# EAGLE design layer4 (EAGLE 9.6.2)

## Sheet 1 of 3: Ultra
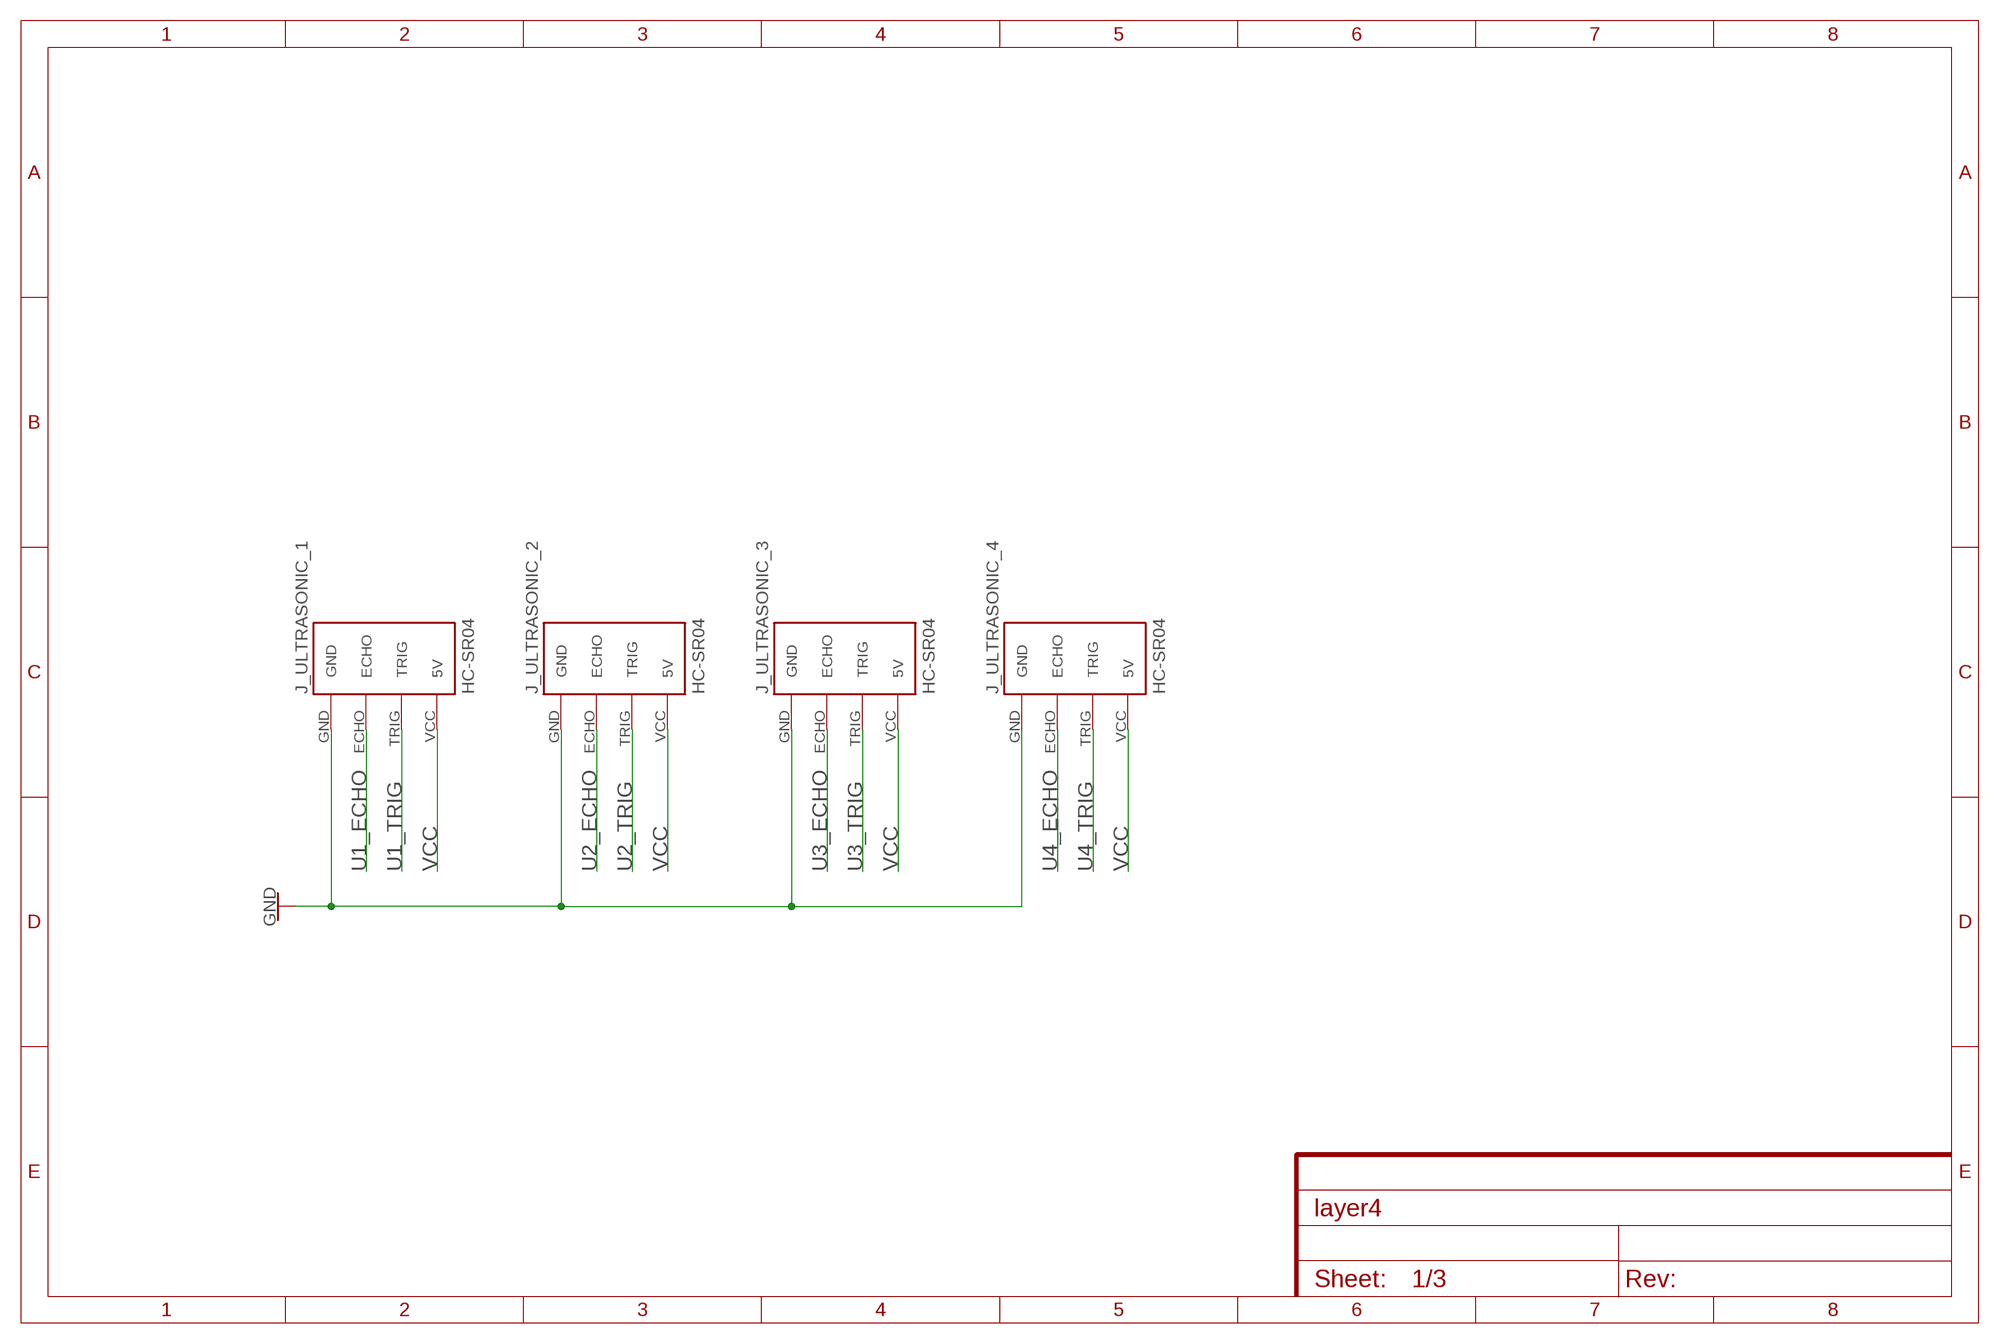
[diagram p0: schematic, sheet 1]

### Parts
J_ULTRASONIC_1  HC-SR04  [HC-SR04_FOOTPRINT]
J_ULTRASONIC_2  HC-SR04  [HC-SR04_FOOTPRINT]
J_ULTRASONIC_3  HC-SR04  [HC-SR04_FOOTPRINT]
J_ULTRASONIC_4  HC-SR04  [HC-SR04_FOOTPRINT]

### Nets
GND: J_ULTRASONIC_1.GND J_ULTRASONIC_2.GND J_ULTRASONIC_3.GND J_ULTRASONIC_4.GND ; also sheet 2,3
U1_ECHO: J_ULTRASONIC_1.ECHO ; also sheet 3
U1_TRIG: J_ULTRASONIC_1.TRIG ; also sheet 3
U2_ECHO: J_ULTRASONIC_2.ECHO ; also sheet 3
U2_TRIG: J_ULTRASONIC_2.TRIG ; also sheet 3
U3_ECHO: J_ULTRASONIC_3.ECHO ; also sheet 3
U3_TRIG: J_ULTRASONIC_3.TRIG ; also sheet 3
U4_ECHO: J_ULTRASONIC_4.ECHO ; also sheet 3
U4_TRIG: J_ULTRASONIC_4.TRIG ; also sheet 3
VCC: J_ULTRASONIC_1.VCC(5V) J_ULTRASONIC_2.VCC(5V) J_ULTRASONIC_3.VCC(5V) J_ULTRASONIC_4.VCC(5V) ; also sheet 3

## Sheet 2 of 3: Compass
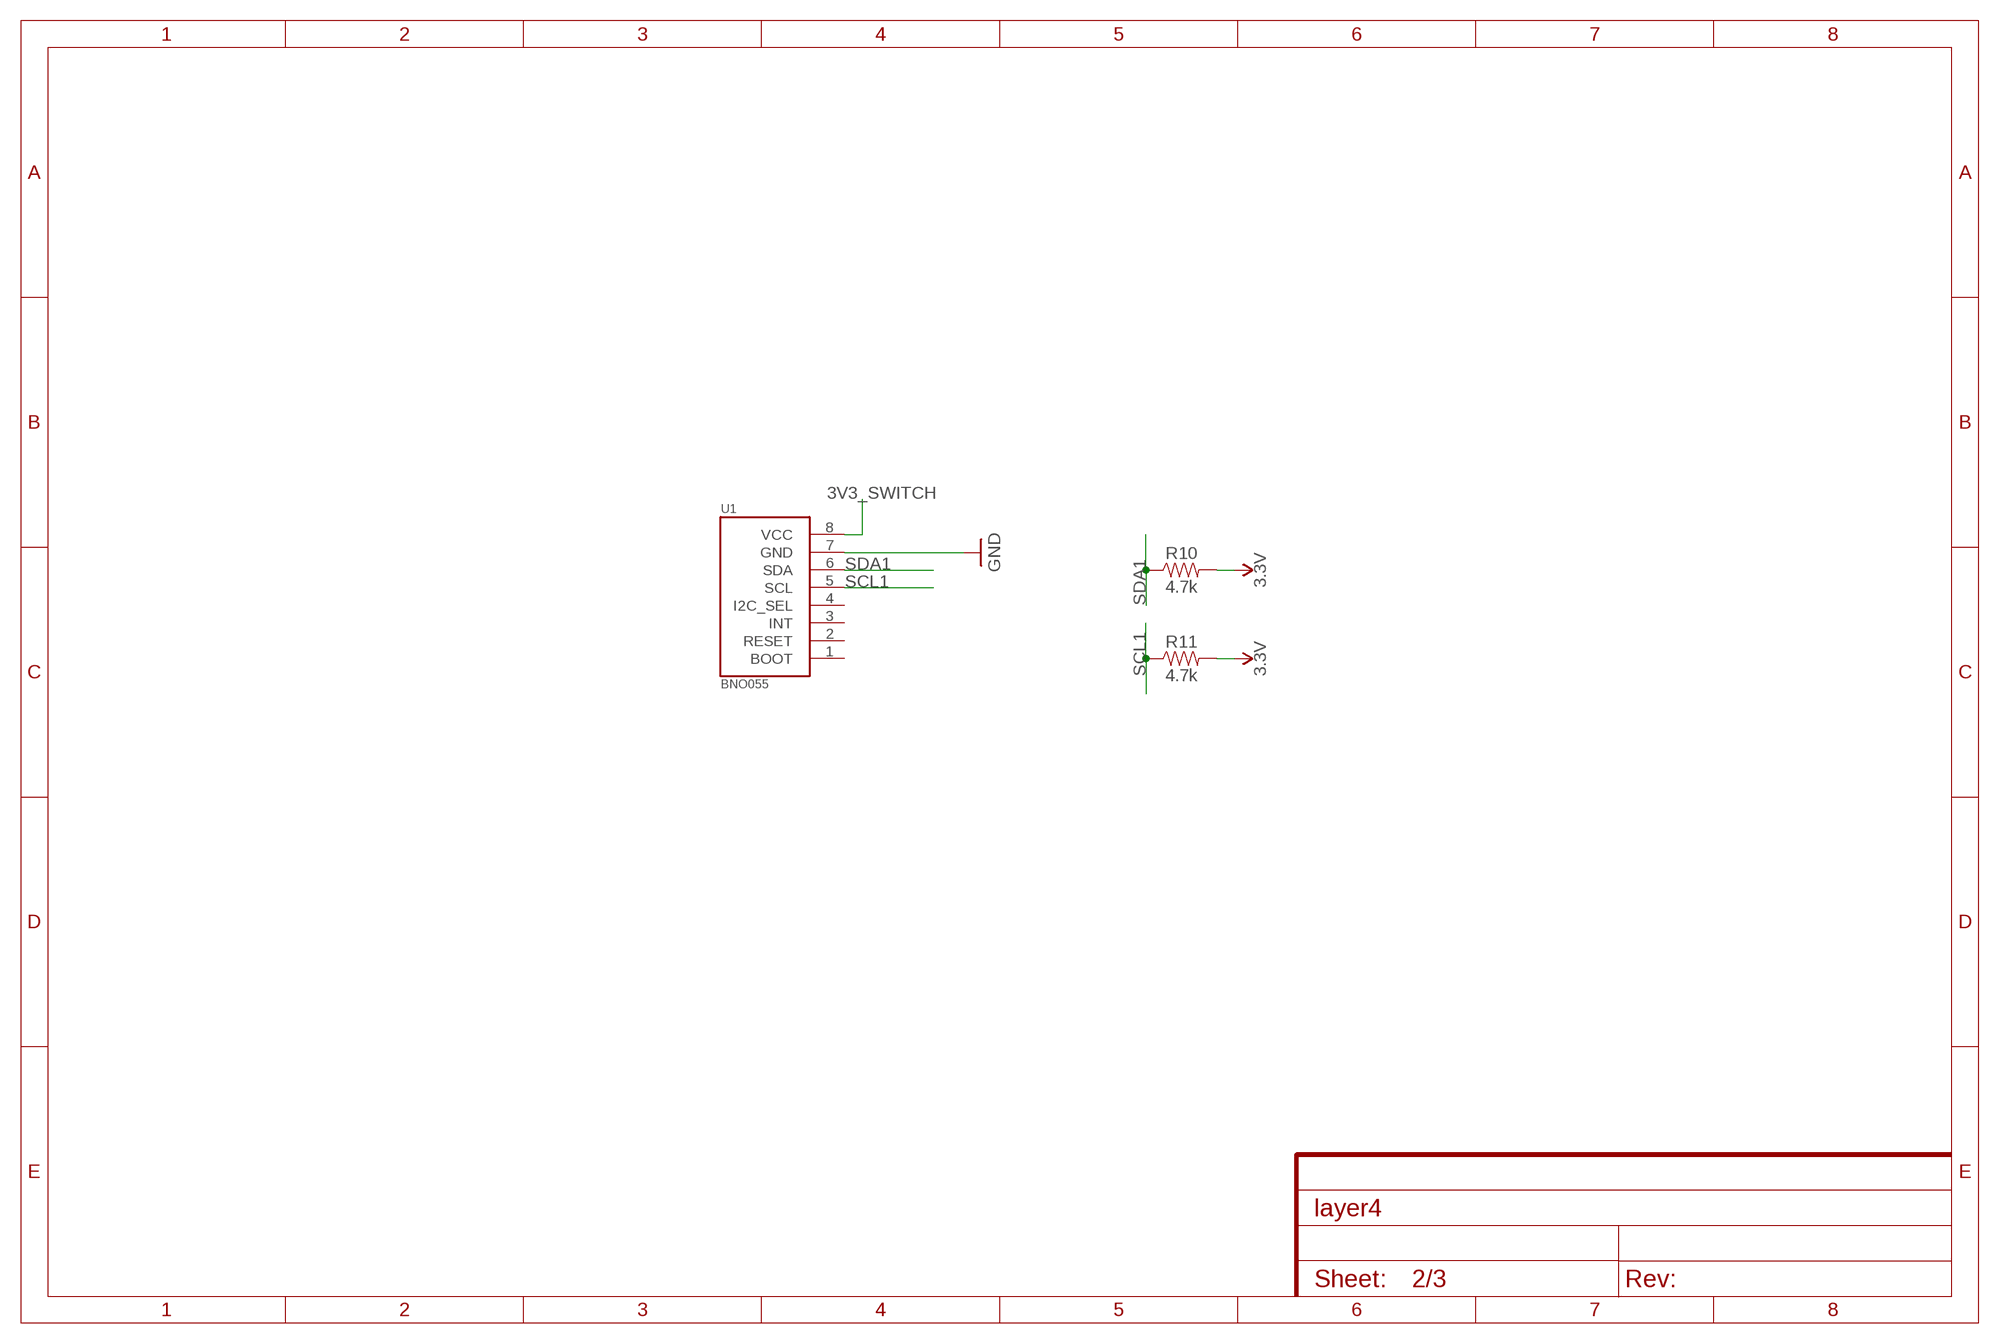
[diagram p1: schematic, sheet 2]

### Parts
R10  4.7k  4.7KOHM-0603-1/10W-1%  [0603]
R11  4.7k  4.7KOHM-0603-1/10W-1%  [0603]
U1  BNO055  [BNO055]

### Nets
3.3V: R10.2 R11.2
3V3_SWITCH: U1.8(VCC) ; also sheet 3
GND: U1.7(GND) ; also sheet 1,3
SCL1: R11.1 U1.5(SCL) ; also sheet 3
SDA1: R10.1 U1.6(SDA) ; also sheet 3
Unconnected: U1.1(BOOT) U1.2(RESET) U1.3(INT) U1.4(I2C_SEL)

## Sheet 3 of 3: STM32
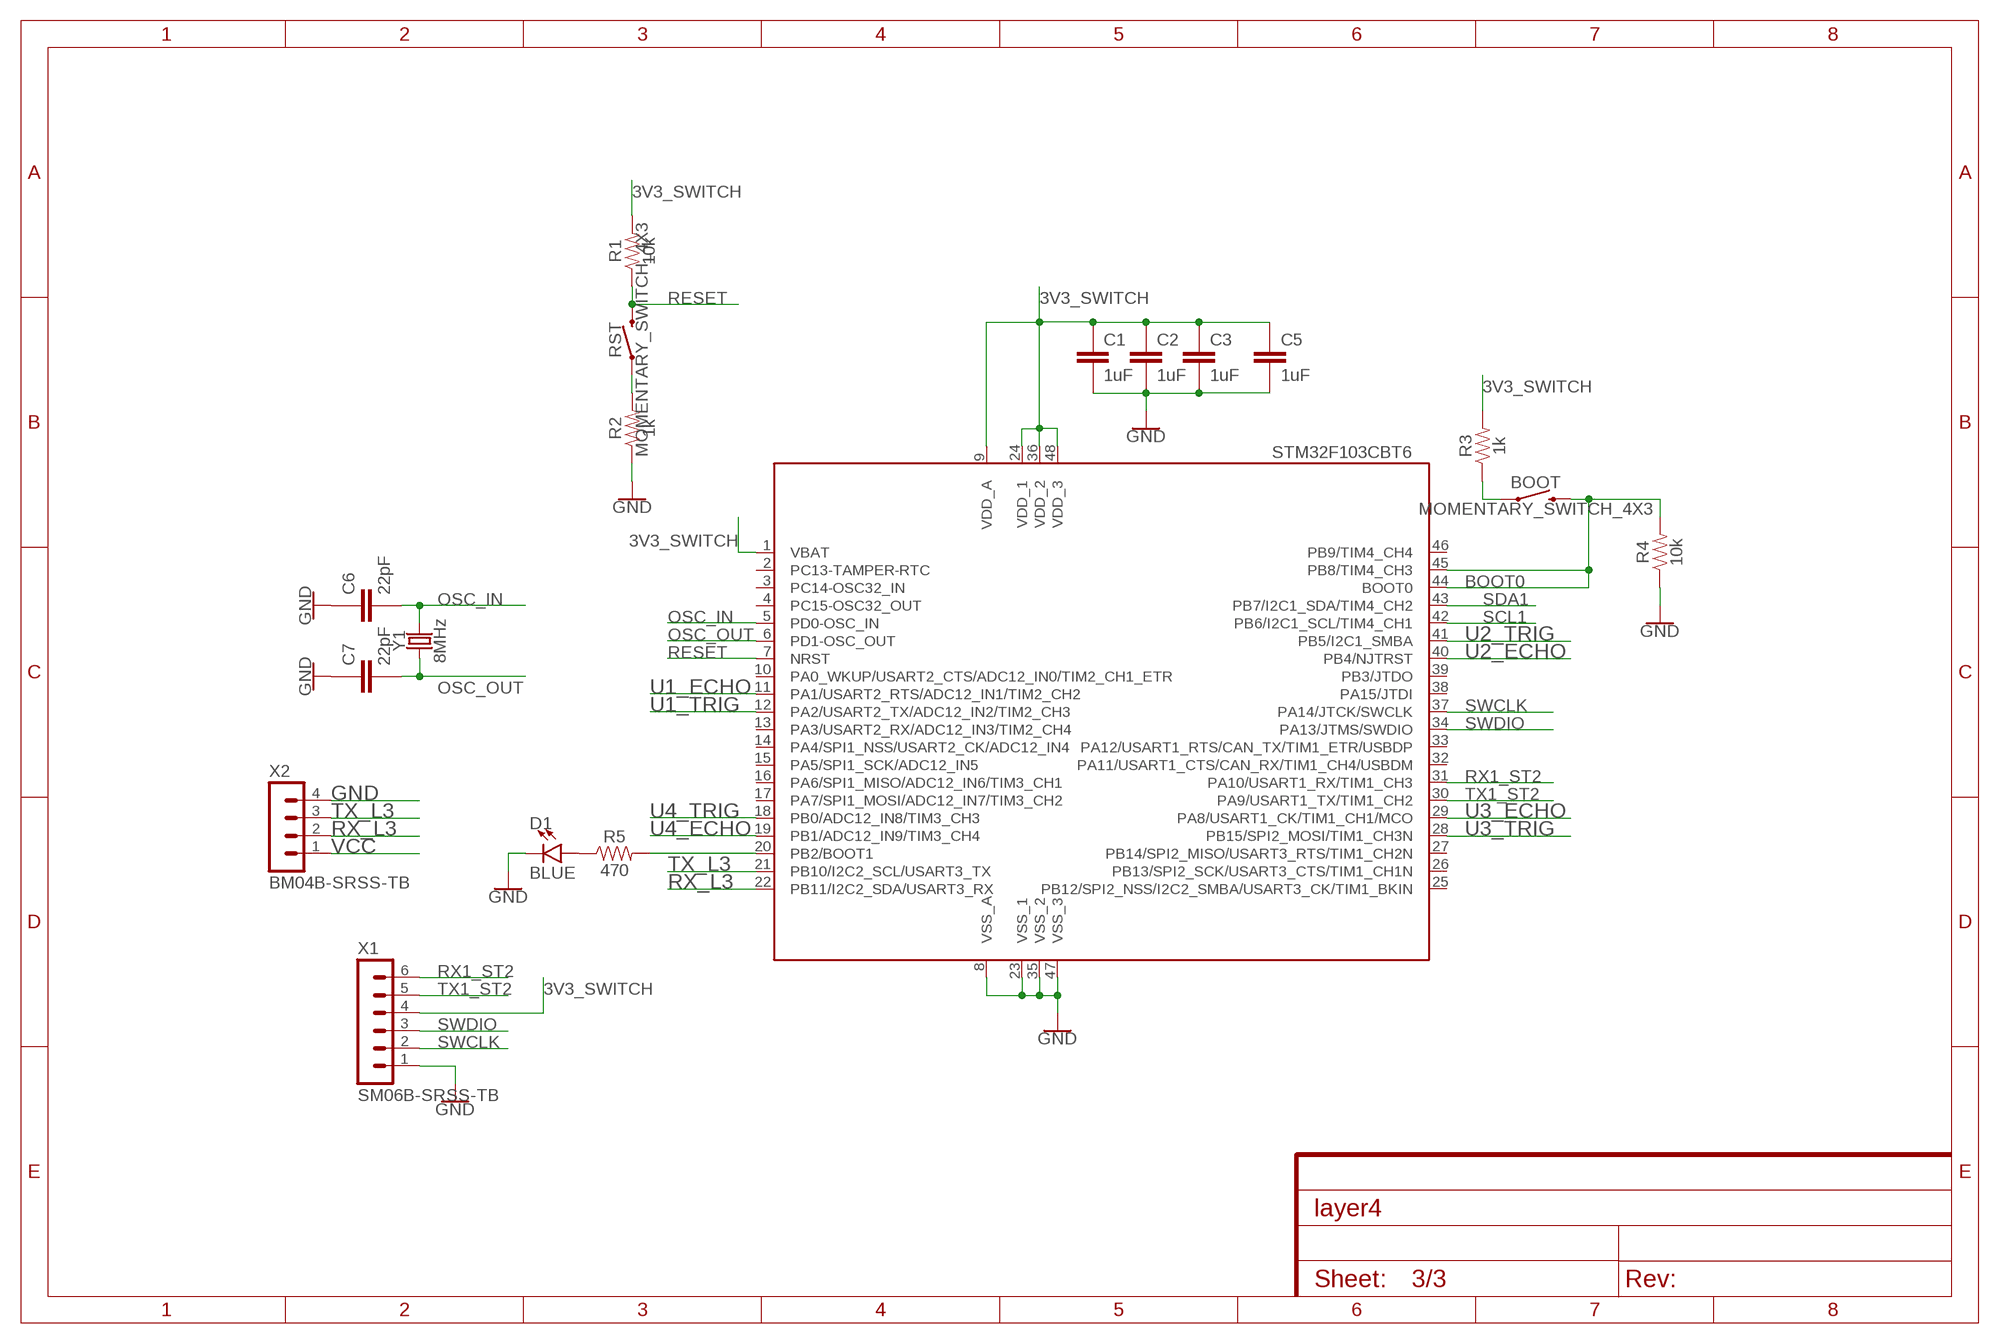
[diagram p2: schematic, sheet 3]

### Parts
BOOT  MOMENTARY_SWITCH_4X3  [MOMENTARY_SWITCH_4X3]
C1  1uF  CAPACITOR0603  [C0603]
C2  1uF  CAPACITOR0603  [C0603]
C3  1uF  CAPACITOR0603  [C0603]
C5  1uF  CAPACITOR0603  [C0603]
C6  22pF  CAPACITOR0603  [C0603]
C7  22pF  CAPACITOR0603  [C0603]
D1  BLUE  LED0603  [LED-0603]
R1  10k  RESISTOR0603  [R0603]
R2  1k  RESISTOR0603  [R0603]
R3  1k  RESISTOR0603  [R0603]
R4  10k  RESISTOR0603  [R0603]
R5  470  RESISTOR0603  [R0603]
RST  MOMENTARY_SWITCH_4X3  [MOMENTARY_SWITCH_4X3]
STM32_IR  STM32F103CBT6  [LQFP48]
X1  SM06B-SRSS-TB  [SM06B-SRSS-TB]
X2  BM04B-SRSS-TB  [BM04B-SRSS-TB]
Y1  8MHz  CRYSTALSMD-5X3.2-2PAD  [CRYSTAL-SMD-5X3.2-2PAD]

### Nets
3V3_SWITCH: C1.1 C2.1 C3.1 C5.2 R1.2 R3.2 STM32_IR.1(VBAT) STM32_IR.9(VDD_A) STM32_IR.24(VDD_1) STM32_IR.36(VDD_2) STM32_IR.48(VDD_3) X1.4 ; also sheet 2
BOOT0: BOOT.P$2 R4.2 STM32_IR.44(BOOT0) STM32_IR.45(PB8/TIM4_CH3)
GND: C1.2 C2.2 C3.2 C5.1 C6.1 C7.1 D1.C R2.1 R4.1 STM32_IR.8(VSS_A) STM32_IR.23(VSS_1) STM32_IR.35(VSS_2) STM32_IR.47(VSS_3) X1.1 X2.4 ; also sheet 1,2
N$70: R2.2 RST.P$1
N$72: BOOT.P$1 R3.1
N$73: R5.2 STM32_IR.20(PB2/BOOT1)
N$74: D1.A R5.1
OSC_IN: C6.2 STM32_IR.5(PD0-OSC_IN) Y1.P$2
OSC_OUT: C7.2 STM32_IR.6(PD1-OSC_OUT) Y1.P$1
RESET: R1.1 RST.P$2 STM32_IR.7(NRST)
RX1_ST2: STM32_IR.31(PA10/USART1_RX/TIM1_CH3) X1.6
RX_L3: STM32_IR.22(PB11/I2C2_SDA/USART3_RX) X2.2
SCL1: STM32_IR.42(PB6/I2C1_SCL/TIM4_CH1) ; also sheet 2
SDA1: STM32_IR.43(PB7/I2C1_SDA/TIM4_CH2) ; also sheet 2
SWCLK: STM32_IR.37(PA14/JTCK/SWCLK) X1.2
SWDIO: STM32_IR.34(PA13/JTMS/SWDIO) X1.3
TX1_ST2: STM32_IR.30(PA9/USART1_TX/TIM1_CH2) X1.5
TX_L3: STM32_IR.21(PB10/I2C2_SCL/USART3_TX) X2.3
U1_ECHO: STM32_IR.11(PA1/USART2_RTS/ADC12_IN1/TIM2_CH2) ; also sheet 1
U1_TRIG: STM32_IR.12(PA2/USART2_TX/ADC12_IN2/TIM2_CH3) ; also sheet 1
U2_ECHO: STM32_IR.40(PB4/NJTRST) ; also sheet 1
U2_TRIG: STM32_IR.41(PB5/I2C1_SMBA) ; also sheet 1
U3_ECHO: STM32_IR.29(PA8/USART1_CK/TIM1_CH1/MCO) ; also sheet 1
U3_TRIG: STM32_IR.28(PB15/SPI2_MOSI/TIM1_CH3N) ; also sheet 1
U4_ECHO: STM32_IR.19(PB1/ADC12_IN9/TIM3_CH4) ; also sheet 1
U4_TRIG: STM32_IR.18(PB0/ADC12_IN8/TIM3_CH3) ; also sheet 1
VCC: X2.1 ; also sheet 1
Unconnected: STM32_IR.2(PC13-TAMPER-RTC) STM32_IR.3(PC14-OSC32_IN) STM32_IR.4(PC15-OSC32_OUT) STM32_IR.10(PA0_WKUP/USART2_CTS/ADC12_IN0/TIM2_CH1_ETR) STM32_IR.13(PA3/USART2_RX/ADC12_IN3/TIM2_CH4) STM32_IR.14(PA4/SPI1_NSS/USART2_CK/ADC12_IN4) STM32_IR.15(PA5/SPI1_SCK/ADC12_IN5) STM32_IR.16(PA6/SPI1_MISO/ADC12_IN6/TIM3_CH1) STM32_IR.17(PA7/SPI1_MOSI/ADC12_IN7/TIM3_CH2) STM32_IR.25(PB12/SPI2_NSS/I2C2_SMBA/USART3_CK/TIM1_BKIN) STM32_IR.26(PB13/SPI2_SCK/USART3_CTS/TIM1_CH1N) STM32_IR.27(PB14/SPI2_MISO/USART3_RTS/TIM1_CH2N) STM32_IR.32(PA11/USART1_CTS/CAN_RX/TIM1_CH4/USBDM) STM32_IR.33(PA12/USART1_RTS/CAN_TX/TIM1_ETR/USBDP) STM32_IR.38(PA15/JTDI) STM32_IR.39(PB3/JTDO) STM32_IR.46(PB9/TIM4_CH4)

## Library data of the parts
BOOT RST = MY-LIBRARY:MOMENTARY_SWITCH_4X3
C1-C3 C5-C7 = JH:CAPACITOR
D1 = SparkFun-LED:LED: LED (Generic) Standard schematic elements and footprints for 5mm, 3mm, 1206, and 0603 sized LEDs. Generic LEDs with no color specified.
J_ULTRASONIC_1-J_ULTRASONIC_4 = Ultrasonic Sensor HC-SR04:HC-SR04: Ultrasonic Sensor HC-SR04
R1-R5 = JH:RESISTOR
R10 R11 = SparkFun-Resistors:4.7KOHM: 4.7kΩ resistor A resistor is a passive two-terminal electrical component that implements electrical resistance as a circuit element. Resistors act to reduce current flow, and, at the same time, act to lower voltage levels within circuits. - Wikipedia; PROD_ID: RES-07857
STM32_IR = JH:STM32F103CBT6
U1 = JH:BNO055
X1 = con-JST SH:SM06B-SRSS: JST SH series header 1.00mm pitch disconnectable crimp style connectors, horizontal (side entry type), 6 pins
X2 = con-JST SH:BM04B-SRSS: JST SH series header 1.00mm pitch disconnectable crimp style connectors, vertical (side entry type), 4 pins
Y1 = SparkFun-Clocks:CRYSTAL: Crystals (Generic) These are passive quartz crystals, which can be used as a clock source for a microcontroller. Crystal's are two-terminal devices. They require external "load" capacitors to generate an oscillating signal.

## Board
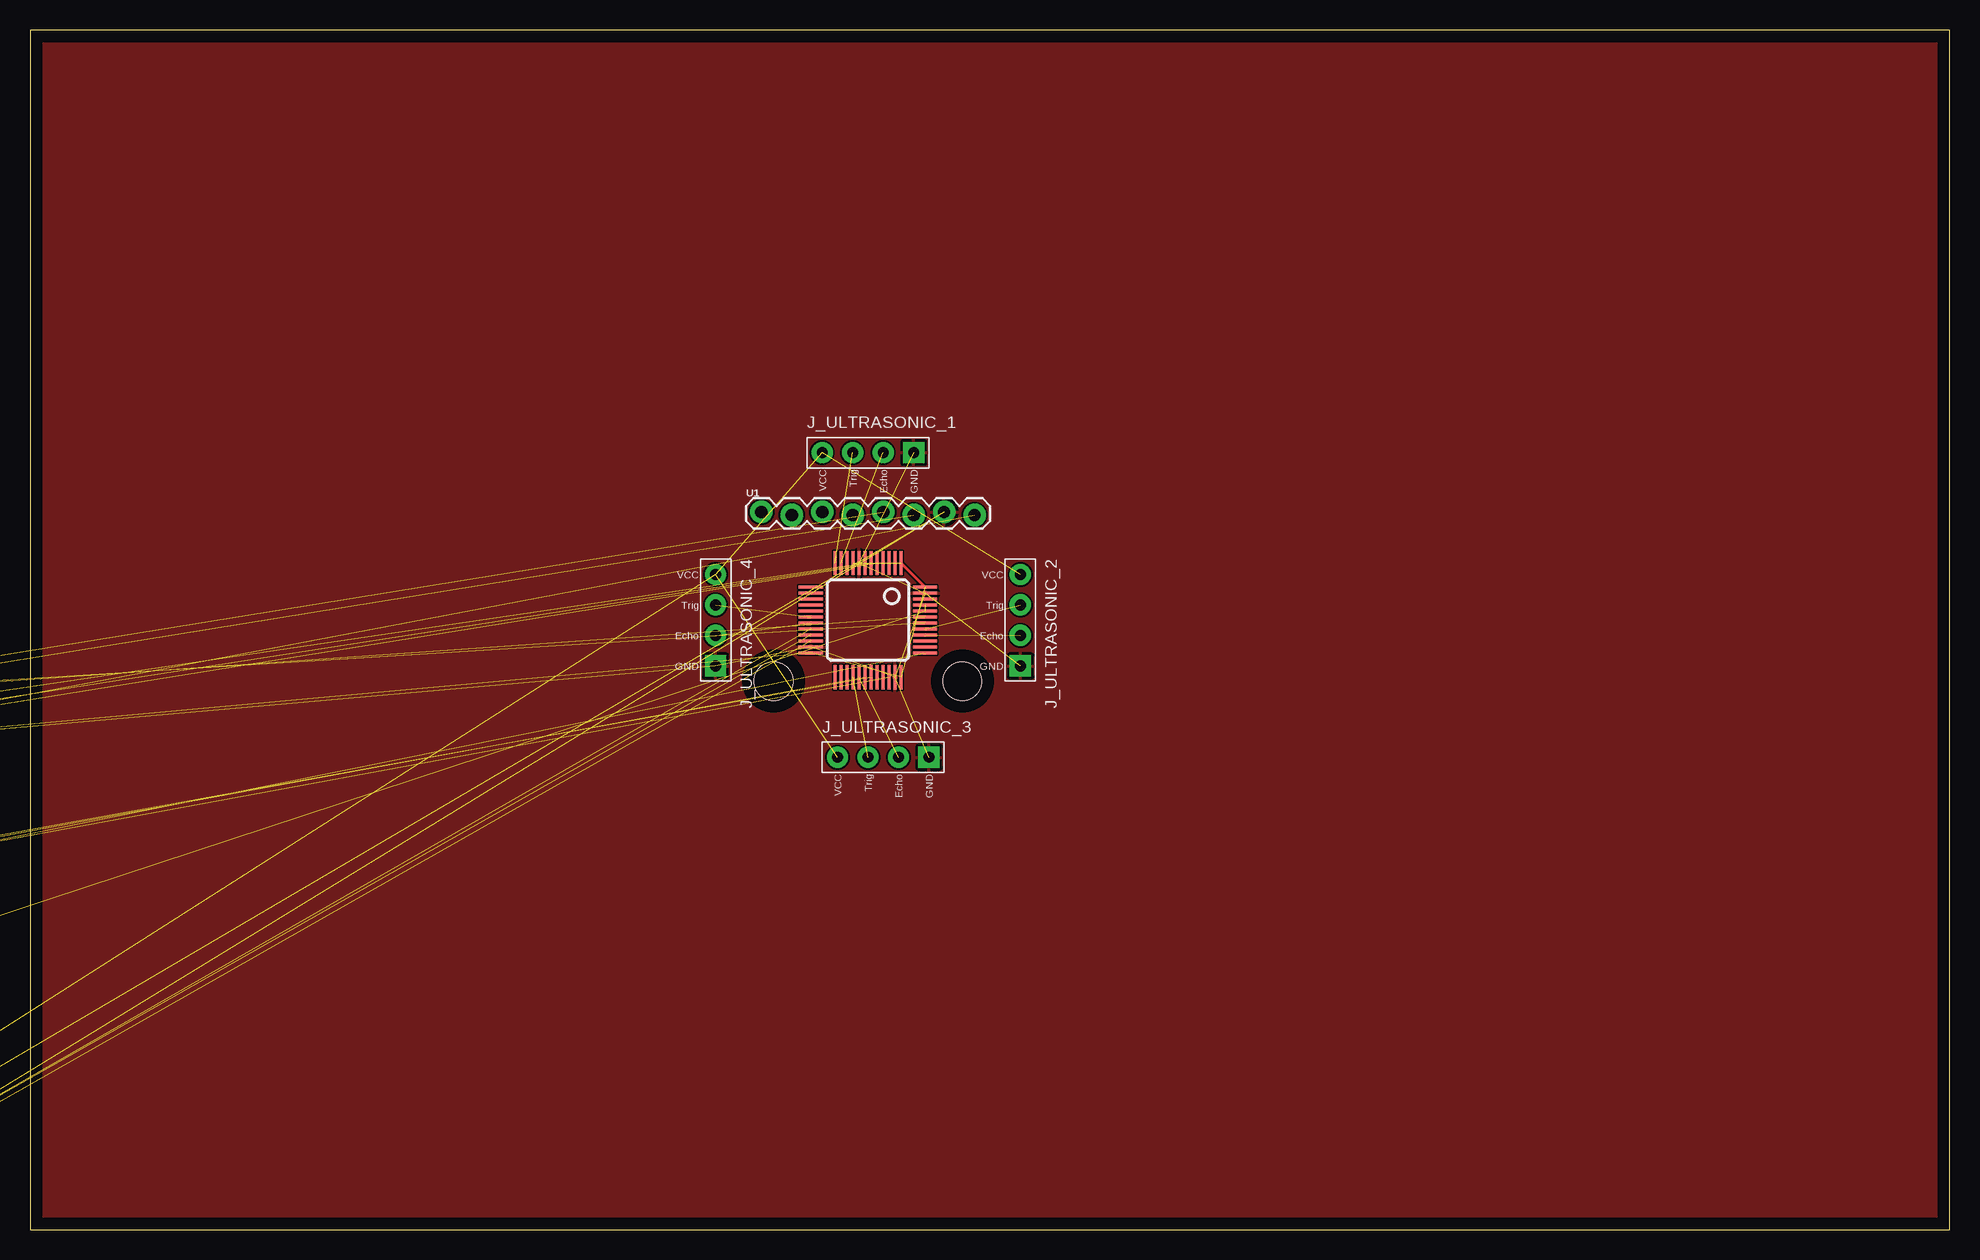
[diagram p3: board, top side]
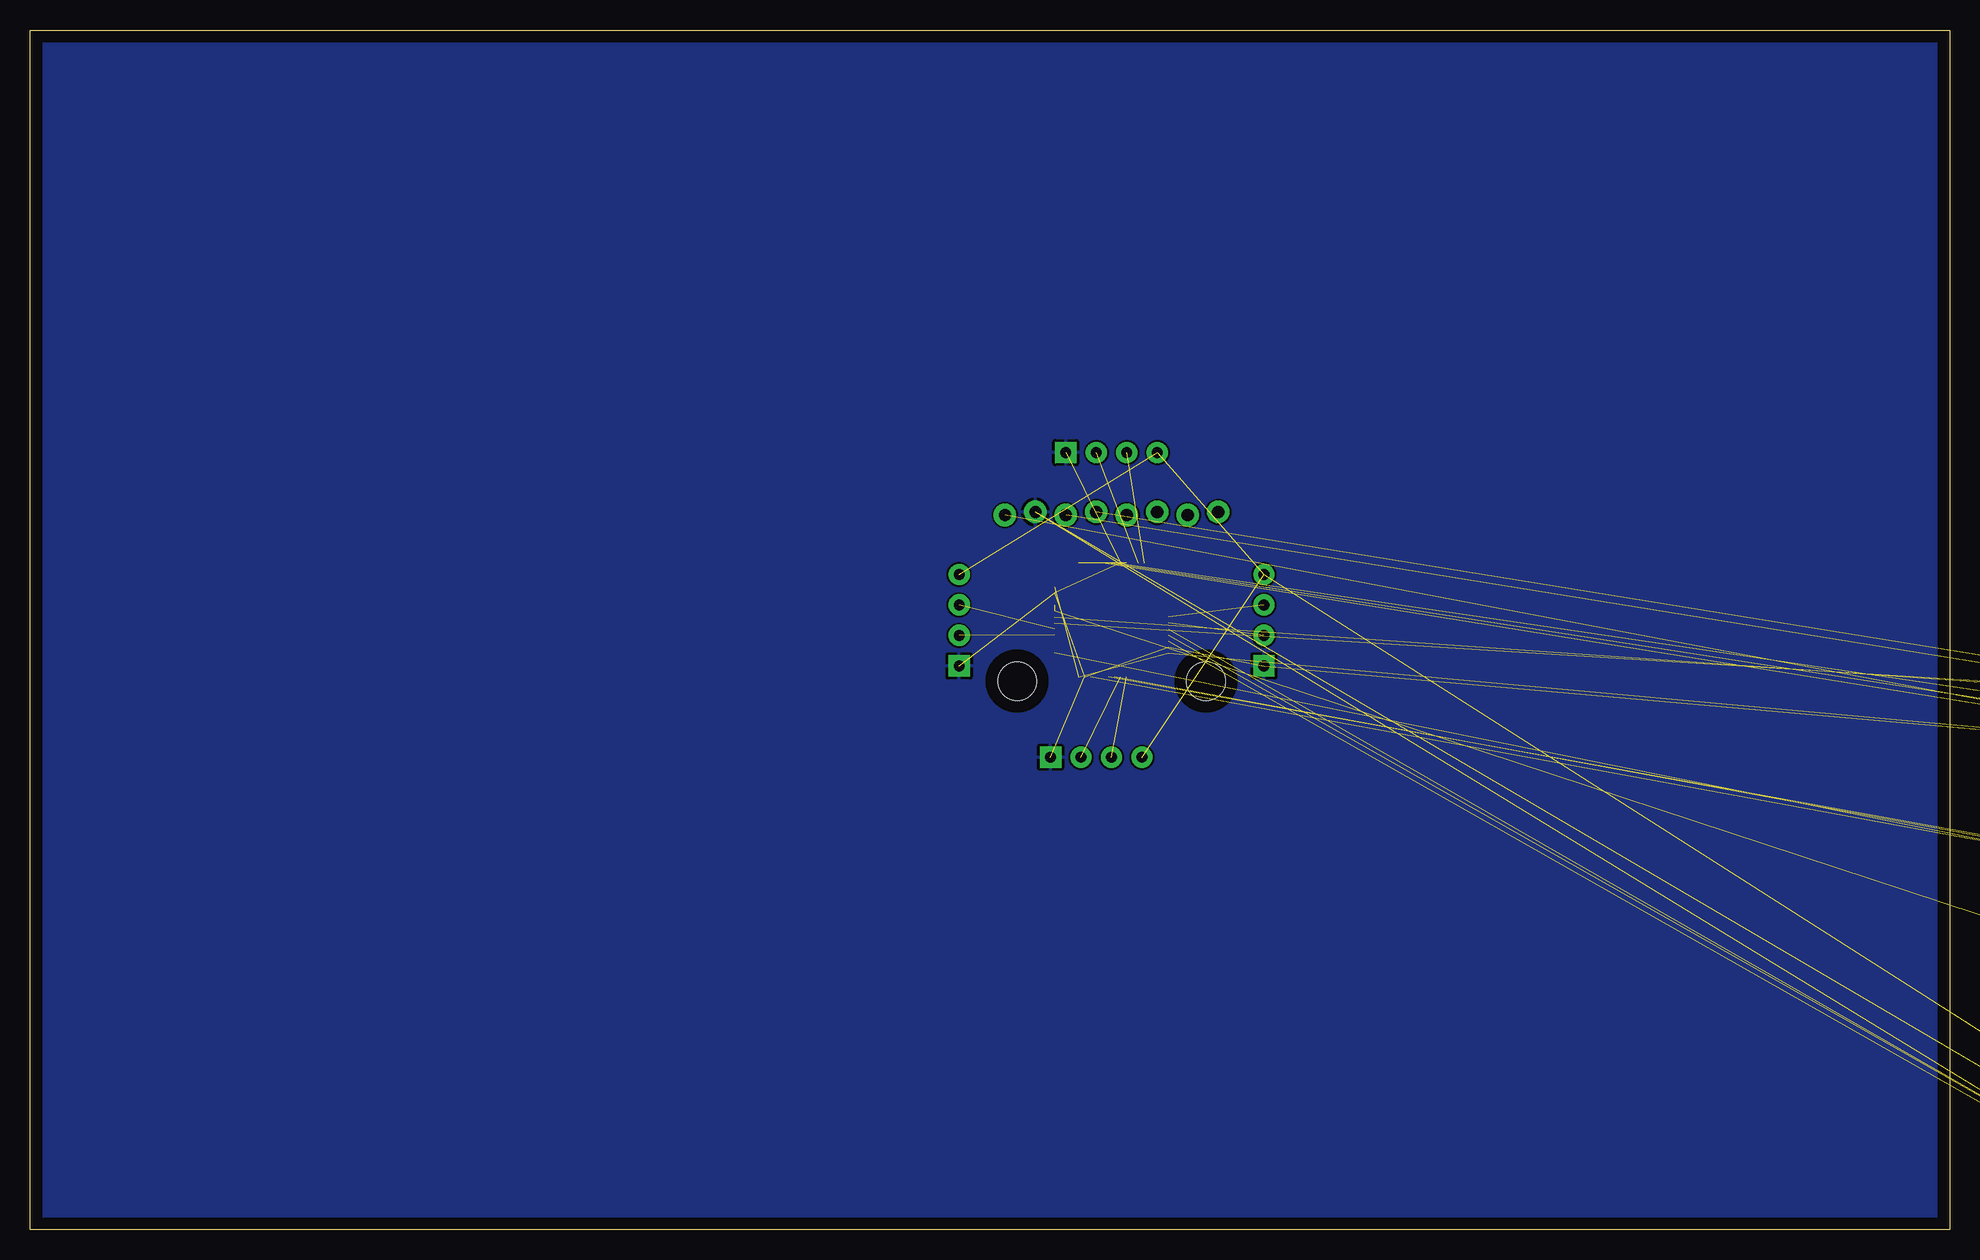
[diagram p4: board, bottom side, seen from below]

Size 160 x 100 mm. Coordinates in mm from the lower left corner, seen from the top.
Outline: 0,0 160,0 160,100 0,100 0,0
Copper layers (1*16): Top 0.035mm / dielectric 1.5mm / Bottom 0.035mm
Design rules "default": minimum track width 6mil, minimum drill 0.35mm, track to track 6mil, track to pad 6mil, pad to pad 6mil, via to via 6mil, smd to smd 6mil, copper to edge 40mil, drill to drill 6mil, minimum pad ring 10mil, minimum via ring 8mil, stop-mask expansion 4mil, vias tented up to drill 0mil, thermal gap 10mil

### Footprints (pad centres in the part's own frame; a part is rotated, then mirrored left to right if it is on the bottom)
MOMENTARY_SWITCH_4X3 = smd 1.3 x 1.6: P$1 -2.25,0; P$2 2.25,0
C0603 = smd 1.1 x 1: 1 -0.85,0; 2 0.85,0
LED-0603 = smd 1 x 1: A -0.877,0; C 0.877,0
HC-SR04_FOOTPRINT = drill 0.9 pad 1.778: ECHO 0,1.27; TRIG 0,-1.27; VCC 0,-3.81 | drill 0.9 pad 1.778 square: GND 0,3.81
R0603 = smd 1.1 x 1: 1 -0.85,0; 2 0.85,0
0603 = smd 1.1 x 1: 1 -0.85,0; 2 0.85,0
LQFP48 = smd 0.254 x 2.032: 1 -2.75,-4.758; 2 -2.25,-4.758; 3 -1.75,-4.758; 4 -1.25,-4.758; 5 -0.75,-4.758; 6 -0.25,-4.758; 7 0.25,-4.758; 8 0.75,-4.758; 9 1.25,-4.758; 10 1.75,-4.758; 11 2.25,-4.758; 12 2.75,-4.758; 25 2.75,4.758; 26 2.25,4.758; 27 1.75,4.758; 28 1.25,4.758; 29 0.75,4.758; 30 0.25,4.758; 31 -0.25,4.758; 32 -0.75,4.758; 33 -1.25,4.758; 34 -1.75,4.758; 35 -2.25,4.758; 36 -2.75,4.758 | smd 2.032 x 0.254: 13 4.758,-2.75; 14 4.758,-2.25; 15 4.758,-1.75; 16 4.758,-1.25; 17 4.758,-0.75; 18 4.758,-0.25; 19 4.758,0.25; 20 4.758,0.75; 21 4.758,1.25; 22 4.758,1.75; 23 4.758,2.25; 24 4.758,2.75; 37 -4.758,2.75; 38 -4.758,2.25; 39 -4.758,1.75; 40 -4.758,1.25; 41 -4.758,0.75; 42 -4.758,0.25; 43 -4.758,-0.25; 44 -4.758,-0.75; 45 -4.758,-1.25; 46 -4.758,-1.75; 47 -4.758,-2.25; 48 -4.758,-2.75
BNO055 = drill 1.016 pad 1.88: 1 -8.89,14.097; 2 -6.35,13.843; 3 -3.81,14.097; 4 -1.27,13.843; 5 1.27,14.097; 6 3.81,13.843; 7 6.35,14.097; 8 8.89,13.843 | hole 3.2: -7.874,0; 7.874,0
SM06B-SRSS-TB = smd 0.6 x 1.55: 1 2.5,0; 2 1.5,0; 3 0.5,0; 4 -0.5,0; 5 -1.5,0; 6 -2.5,0 | smd 1.2 x 1.8: M1 3.8,3.875; M2 -3.8,3.875
BM04B-SRSS-TB = smd 0.6 x 1.55: 1 1.5,0; 2 0.5,0; 3 -0.5,0; 4 -1.5,0 | smd 1.2 x 1.8: M1 2.8,-2.525; M2 -2.8,-2.525
CRYSTAL-SMD-5X3.2-2PAD = smd 1.7 x 2.4: P$1 1.85,0; P$2 -1.85,0

### Placement (x,y rotation side)
BOOT  -34.29,16.51 0 top  (outside the outline)
C1  -36.83,36.83 0 top  (outside the outline)
C2  -40.64,36.83 0 top  (outside the outline)
C3  -15.24,40.64 0 top  (outside the outline)
C5  -19.05,40.64 0 top  (outside the outline)
C6  -22.86,40.64 0 top  (outside the outline)
C7  -26.67,40.64 0 top  (outside the outline)
D1  -118.11,-58.42 0 top  (outside the outline)
J_ULTRASONIC_1  69.85,64.77 270 top
J_ULTRASONIC_2  82.55,50.8 180 top
J_ULTRASONIC_3  71.12,39.37 270 top
J_ULTRASONIC_4  57.15,50.8 180 top
R1  -30.48,40.64 0 top  (outside the outline)
R2  -34.29,40.64 0 top  (outside the outline)
R3  -38.1,40.64 0 top  (outside the outline)
R4  -41.91,40.64 0 top  (outside the outline)
R5  -118.11,-54.61 0 top  (outside the outline)
R10  -19.05,44.45 0 top  (outside the outline)
R11  -22.86,44.45 0 top  (outside the outline)
RST  -34.29,24.13 0 top  (outside the outline)
STM32_IR  69.85,50.8 180 top
U1  69.85,45.72 0 top
X1  -20.32,29.21 0 top  (outside the outline)
X2  -97.79,-43.18 0 top  (outside the outline)
Y1  -33.02,30.48 0 top  (outside the outline)

### Tracks (layer width: path | path; a pad name or v marks a point on that pad's centre or on a via)
3.3V  (1 unrouted)
3V3_SWITCH  (11 unrouted)
  Top 0.254: STM32_IR.48 STM32_IR.1
BOOT0  (3 unrouted)
GND  (19 unrouted)
  pour Top: -139.7,187.96 -139.7,-66.04 298.45,-66.04 298.45,187.96
  pour Bottom: -138.43,190.5 -138.43,-64.77 300.99,-64.77 300.99,190.5
N$70  (1 unrouted)
N$72  (1 unrouted)
N$73  (1 unrouted)
N$74  (1 unrouted)
OSC_IN  (2 unrouted)
OSC_OUT  (2 unrouted)
RESET  (2 unrouted)
RX1_ST2  (1 unrouted)
RX_L3  (1 unrouted)
SCL1  (2 unrouted)
SDA1  (2 unrouted)
SWCLK  (1 unrouted)
SWDIO  (1 unrouted)
TX1_ST2  (1 unrouted)
TX_L3  (1 unrouted)
U1_ECHO  (1 unrouted)
U1_TRIG  (1 unrouted)
U2_ECHO  (1 unrouted)
U2_TRIG  (1 unrouted)
U3_ECHO  (1 unrouted)
U3_TRIG  (1 unrouted)
U4_ECHO  (1 unrouted)
U4_TRIG  (1 unrouted)
VCC  (4 unrouted)